# Altium project nrf52840_ckaa_var1.PrjPCB
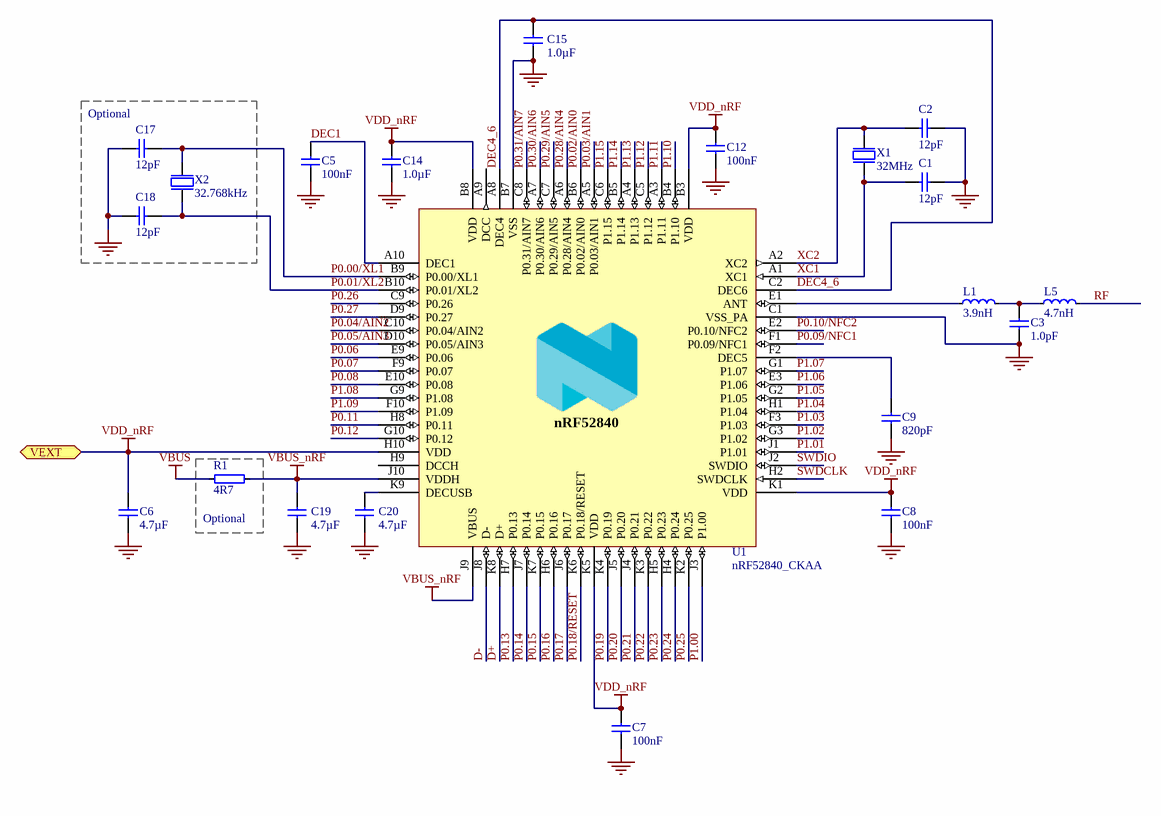
[diagram p0: nrf52840_ckaa_var1.SchDoc]
1 sheet, 21 parts. Net scope: flat (ports and power ports of the same name join across sheets).
Board file: nrf52840_ckaa_var1.PcbDoc

## Sheet nrf52840_ckaa_var1.SchDoc: nRF52840-CKAA Ref. Layout (LDO only, VBUS supply)
size A4; Revision: 1.0; SheetNumber: 1; SheetTotal: 1; DrawnBy: RUBR; DocumentSize: nRF52840-CKAA Ref. Layout (LDO only, VBUS supply); PCAName: nRF52840-CKAA Ref. Layout (LDO only, VBUS supply)

### Parts
C1  12pF  [CAPC0603X03L_C]
C2  12pF  [CAPC0603X03L_C]
C3  1.0pF  [CAPC0603X03L_C]
C5  100nF  [CAPC0603X03L_C]
C6  4.7µF  [CAPC1608X06L]
C7  100nF  [CAPC0603X03L_C]
C8  100nF  [CAPC0603X03L_C]
C9  820pF  [CAPC0603X03L_C]
C12  100nF  [CAPC0603X03L_C]
C14  1.0µF  [CAPC1608X06L]
C15  1.0µF  [CAPC1608X06L]
C17  12pF  [CAPC0603X03L_C]
C18  12pF  [CAPC0603X03L_C]
C19  4.7µF  [CAPC1608X06L]
C20  4.7µF  [CAPC1608X06L]
L1  3.9nH  [INDC0603X03L_C]
L5  4.7nH  [INDC0603X03L_C]
R1  4R7  [RESC0603X03L_C]
U1  nRF52840_CKAA  [BGA94C35P10X10_352X356X50]
X1  32MHz  [BT-XTAL_2016]
X2  32.768kHz  [XTAL_2012]

### Blocks framed on the sheet
Optional: C17 C18 X2
Optional: R1

### Ports
VEXT (bidir)

### Nets
GND: C1.2 C2.2 C3.1 C5.2 C6.2 C7.2 C8.2 C9.2 C12.2 C14.2 C15.1 C17.2 C18.2 C19.2 C20.2 U1.B7(VSS) U1.C1(VSS_PA) U1.C4(GND) U1.D3(GND) U1.D4(GND) U1.D5(GND) U1.D6(GND) U1.D7(GND) U1.D8(GND) U1.E4(GND) U1.E5(GND) U1.E6(GND) U1.E7(GND) U1.E8(GND) U1.F4(GND) U1.F5(GND) U1.F6(GND) U1.F7(GND) U1.F8(GND) U1.G4(GND) U1.G5(GND) U1.G6(GND) U1.G7(GND) U1.G8(GND) U1.K10(GND) X1.2(GND) X1.4(GND)
VBUS: R1.1
VBUS_nRF: C19.1 R1.2 U1.J9(VBUS) U1.J10(VDDH)
VDD_nRF: C6.1 C7.1 C8.1 C12.1 C14.1 U1.B3(VDD) U1.B8(VDD) U1.H10(VDD) U1.K1(VDD) U1.K5(VDD) ; port VEXT
D+: U1.K8(D+)
D-: U1.J8(D-)
DEC1: C5.1 U1.A10(DEC1)
DEC4_6: C15.2 U1.A8(DEC4) U1.C2(DEC6)
P0.00/XL1: C17.1 U1.B9(P0.00/XL1) X2.1(inp)
P0.01/XL2: C18.1 U1.B10(P0.01/XL2) X2.2(out)
P0.02/AIN0: U1.B6(P0.02/AIN0)
P0.03/AIN1: U1.A5(P0.03/AIN1)
P0.04/AIN2: U1.C10(P0.04/AIN2)
P0.05/AIN3: U1.D10(P0.05/AIN3)
P0.06: U1.E9(P0.06)
P0.07: U1.F9(P0.07)
P0.08: U1.E10(P0.08)
P0.09/NFC1: U1.F1(P0.09/NFC1)
P0.10/NFC2: U1.E2(P0.10/NFC2)
P0.11: U1.H8(P0.11)
P0.12: U1.G10(P0.12)
P0.13: U1.H7(P0.13)
P0.14: U1.J7(P0.14)
P0.15: U1.K7(P0.15)
P0.16: U1.H6(P0.16)
P0.17: U1.J6(P0.17)
P0.18/RESET: U1.K6(P0.18/RESET)
P0.19: U1.K4(P0.19)
P0.20: U1.J5(P0.20)
P0.21: U1.J4(P0.21)
P0.22: U1.K3(P0.22)
P0.23: U1.H5(P0.23)
P0.24: U1.H4(P0.24)
P0.25: U1.K2(P0.25)
P0.26: U1.C9(P0.26)
P0.27: U1.D9(P0.27)
P0.28/AIN4: U1.A6(P0.28/AIN4)
P0.29/AIN5: U1.C7(P0.29/AIN5)
P0.30/AIN6: U1.A7(P0.30/AIN6)
P0.31/AIN7: U1.C8(P0.31/AIN7)
P1.00: U1.J3(P1.00)
P1.01: U1.J1(P1.01)
P1.02: U1.G3(P1.02)
P1.03: U1.F3(P1.03)
P1.04: U1.H1(P1.04)
P1.05: U1.G2(P1.05)
P1.06: U1.E3(P1.06)
P1.07: U1.G1(P1.07)
P1.08: U1.G9(P1.08)
P1.09: U1.F10(P1.09)
P1.10: U1.B4(P1.10)
P1.11: U1.A3(P1.11)
P1.12: U1.C5(P1.12)
P1.13: U1.A4(P1.13)
P1.14: U1.B5(P1.14)
P1.15: U1.C6(P1.15)
RF: L5.2
SWDCLK: U1.H2(SWDCLK)
SWDIO: U1.J2(SWDIO)
XC1: C1.1 U1.A1(XC1) X1.1(inp)
XC2: C2.1 U1.A2(XC2) X1.3(out)
NetC3_2: C3.2 L1.2 L5.1
NetC9_1: C9.1 U1.F2(DEC5)
NetC20_1: C20.1 U1.K9(DECUSB)
NetL1_1: L1.1 U1.E1(ANT)

Not connected (* = marked no-connect by the designer): U1 A9(DCC) H9(DCCH)

### Notes on the sheet
- Title
- Size
- Date:
- A4
- Project Number
- Sheet         of
- Revision
- File:
- Drawn By:
- (in symbol nRF52840-CKAAD0) nRF52840

### Library data of the parts
C1 C2 C17 C18 = C0201-12p: Capacitor, NP0, ±2%; Part Number: C0201-12p; LatestRevisionDate: 2017-11-09; Pin Count: 2; Publisher: Nordic Semiconductor; Published: 2014-11-13; Value: 12pF; Footprint Doc: 0201; Manufacturer: *; Manufacturer Part Number: *
C3 = C0201-1.0p: Capacitor, NP0, ±5%; Part Number: C0201-1.0p; Manufacturer: *; Manufacturer Part Number: *; LatestRevisionDate: 2018-10-22; Pin Count: 2; Publisher: Nordic Semiconductor; Published: 2014-11-13; Value: 1.0pF; Footprint Doc: 0201
C5 C7 C8 C12 = C0201-100n: Capacitor, X7R, ±10%; Part Number: C0201-100n; LatestRevisionDate: 2017-11-09; Pin Count: 2; Publisher: Nordic Semiconductor; Published: 2014-11-13; Value: 100nF; Footprint Doc: 0201; Manufacturer: *; Manufacturer Part Number: *
C6 C20 = C0603-4µ7-6.3V-X7R: Capacitor, X7R, ±10%; Part Number: C0603-4µ7-6.3V-X7R; LatestRevisionDate: 2015-06-10; Pin Count: 2; Publisher: Nordic Semiconductor; Published: 2015-06-10; Value: 4.7µF; Footprint Doc: 0603
C9 = C0201-820p: Capacitor, X7R, ±10%; Part Number: C0201-820p; LatestRevisionDate: 2017-11-09; Pin Count: 2; Publisher: Nordic Semiconductor; Published: 2014-11-13; Value: 820pF; Footprint Doc: 0201; Manufacturer: *; Manufacturer Part Number: *
C14 C15 = C0603-1µ0: Capacitor, X7R, ±10%; Part Number: C0603-1µ0; LatestRevisionDate: 2013-06-05; Pin Count: 2; Publisher: Nordic Semiconductor; Published: 2009-05-08; Value: 1.0µF; Footprint Doc: 0603; Manufacturer: *; Manufacturer Part Number: *
C19 = C0603-4µ7-10V-X7S: Capacitor, X7S, ±10%; Part Number: C0603-4µ7-10V-X7S; LatestRevisionDate: 2016-08-15; Pin Count: 2; Publisher: Nordic Semiconductor; Published: 2016-08-15; Value: 4.7µF; Footprint Doc: 0603; Manufacturer: *; Manufacturer Part Number: *
L1 = L0201-3n9: High frequency chip inductor ±5%; Part Number: L0201-3n9; Manufacturer: *; Manufacturer Part Number: *; LatestRevisionDate: 2017-11-09; Pin Count: 2; Publisher: Nordic Semiconductor; Published: 2013-04-10; Value: 3.9nH; Footprint Doc: 0201
L5 = L0201-4n7: High frequency chip inductor ±5%; Part Number: L0201-4n7; Manufacturer: *; Manufacturer Part Number: *; LatestRevisionDate: 2013-04-10; Pin Count: 2; Publisher: Nordic Semiconductor; Published: 2013-04-10; Value: 4.7nH; Footprint Doc: 0201
R1 = R0201-4R7: Resistor, ±1%, 0.05W; Part Number: R0201-4R7; Manufacturer: *; Manufacturer Part Number: *; Footprint Doc: 0201; LatestRevisionDate: 2014-11-13; Pin Count: 2; Publisher: Nordic Semiconductor; Published: 2014-11-13; Value: 4R7
U1 = nRF52840-CKAAD0: Multi-protocol Bluetooth Low Energy, IEEE 802.15.4, ANT and 2.4GHz proprietary system-on-chip; Manufacturer: Nordic Semiconductor; Part Number: nRF52840-CKAAD0; LatestRevisionDate: 2018-12-17; Pin Count: 94; Publisher: Nordic Semiconductor; Published: 2018-12-17; Value: nRF52840_CKAA; Footprint Doc: WLCSP-94; Manufacturer Part Number: nRF52840-CKAAD0
X1 = XTAL_SMD2016_32MHz_8pF_General: XTAL SMD 2016, 32MHz, Cl=8pF, Total Tol: ±40ppm; Part Number: XTAL_SMD2016_32MHz_8pF_General; LatestRevisionDate: 2016-08-19; Pin Count: 4; Publisher: Nordic Semiconductor; Published: 2016-08-19; Value: 32MHz; Footprint Doc: XTAL_2016; Manufacturer: *; Manufacturer Part Number: *
X2 = XTAL_SMD2012_32.768kHz_9pF_General: XTAL SMD 2012, 32.768kHz, Cl=9pF, Total Tol: ±50ppm; Part Number: XTAL_SMD2012_32.768kHz_9pF_General; LatestRevisionDate: 2017-01-11; Pin Count: 2; Publisher: Nordic Semiconductor; Published: 2016-08-19; Value: 32.768kHz; Footprint Doc: XTAL_2012; Manufacturer: *; Manufacturer Part Number: *